# Altium schematic sheet ClockCircuit.SchDoc
size A; SheetNumber: 3; SheetTotal: 8
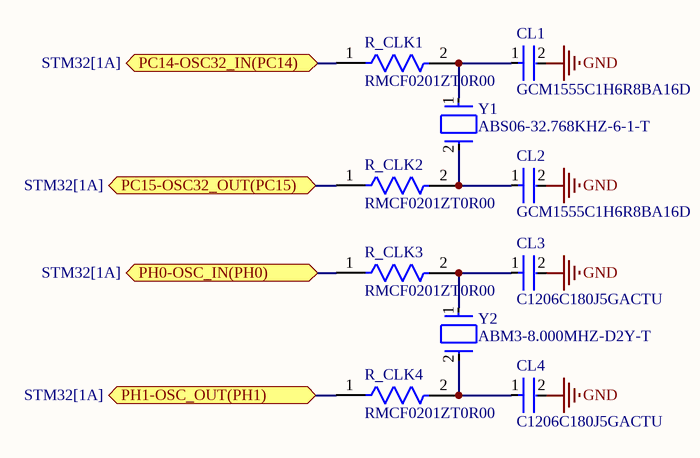
[diagram p0: ClockCircuit.SchDoc]

## Parts
CL1  GCM1555C1H6R8BA16D  [FP-GCM155-0_05-MFG]
CL2  GCM1555C1H6R8BA16D  [FP-GCM155-0_05-MFG]
CL3  C1206C180J5GACTU  [FP-C1206C-EB-MFG]
CL4  C1206C180J5GACTU  [FP-C1206C-EB-MFG]
R_CLK1  RMCF0201ZT0R00  [FP-RMCF0201-IPC_C]
R_CLK2  RMCF0201ZT0R00  [FP-RMCF0201-IPC_C]
R_CLK3  RMCF0201ZT0R00  [FP-RMCF0201-IPC_C]
R_CLK4  RMCF0201ZT0R00  [FP-RMCF0201-IPC_C]
Y1  ABS06-32.768KHZ-6-1-T  [FP-ABS06-MFG]
Y2  ABM3-8.000MHZ-D2Y-T  [FP-ABM3-MFG]

## Ports
PC14-OSC32_IN(PC14) (bidir, see STM32[1A]), PC15-OSC32_OUT(PC15) (bidir, see STM32[1A]), PH0-OSC_IN(PH0) (bidir, see STM32[1A]), PH1-OSC_OUT(PH1) (bidir, see STM32[1A])

## Nets
GND: CL1.2 CL2.2 CL3.2 CL4.2
PC14-OSC32_IN(PC14): R_CLK1.1 ; port PC14-OSC32_IN(PC14)
PC15-OSC32_OUT(PC15): R_CLK2.1 ; port PC15-OSC32_OUT(PC15)
PH0-OSC_IN(PH0): R_CLK3.1 ; port PH0-OSC_IN(PH0)
PH1-OSC_OUT(PH1): R_CLK4.1 ; port PH1-OSC_OUT(PH1)
NetCL1_1: CL1.1 R_CLK1.2 Y1.1
NetCL2_1: CL2.1 R_CLK2.2 Y1.2
NetCL3_1: CL3.1 R_CLK3.2 Y2.1
NetCL4_1: CL4.1 R_CLK4.2 Y2.2

## Library data of the parts
CL1 CL2 = CMP-06035-015550-1: Ceramic Capacitor for Automotive 6.8pF ±0.1pF 50VDC C0G 0402 Paper T/R; Voltage Rating: 50V; Capacitance: 6.8pF; Case/Package: 0402; Packaging: Cut Tape; Max Operating Temperature: 125°C; Mount: Surface Mount; Ratings: AEC-Q200; Min Operating Temperature: -55°C
CL3 CL4 = CMP-1037-00893-2: 1206 C 18pF Ceramic Multilayer Capacitor; 50 VDC; +125degC; C0G Dielec; +/-5%; Manufacturer: KEMET; Tolerance: 0.05; Temperature Coefficient: 15%; Automotive Grade: Grade 0; Voltage Rating: 50 V; Description: C1206 18 pF C0G 5.00% 50 V; Temperature Range High: +150°C; Lead Free: Yes; Device Class L3: Ceramic Capacitors; Capacitance: 18 pF; ComponentLink2Description: Datasheet; ComponentLink2URL: https://content.kemet.com/datasheets/KEM_C1007_X8R_ULTRA_150C_SMD.pdf; Digikey Description: 1206 C 18pF Ceramic Multilayer Capacitor; 50 VDC; +125degC; C0G Dielec; +/-5%; Device Class L1: Passive Components; Automotive: Yes; Temperature Range Low: -55°C; Ipc Land Pattern Name: CAPC320160X78; Temperature Characteristic: C0G; Value: 18 pF; Height: 0.88mm; Mouser Description: 1206 C 18pF Ceramic Multilayer Capacitor; 50 VDC; +125degC; C0G Dielec; +/-5%; Material: Ceramic; Octopart: https://octopart.com/c1206c180j5gactu-kemet-90945; Device Class L2: Capacitors; RoHS: TRUE; Package: C1206C-EB; Manufacturer Part Number: C1206C180J5GACTU; Temperature: -55°C to +150°C; Category: Cap
R_CLK1-R_CLK4 = CMP-26527-001890-1: 0Ω ±0 0.05W 0201 Thick Film Chip Resistor AEC-Q200 compliant; Max Power Dissipation: 50mW; Resistance: 0R; Packaging: Tape and Reel; Case/Package: 0201; Lead Free: Lead Free; Mount: Surface Mount; Series: RMCF; Power Rating: 50mW; Max Operating Temperature: 125°C; Resistor Type: Thick Film; Height - Seated (Max): 0.01inch; Package Quantity: 10000; RoHS Compliant: Yes; Case Code (Metric): 0603; Height: 0.009inch; Radiation Hardening: No; Case Code (Imperial): 0201; Number of Terminations: 2; Contact Plating: Tin; Width: 0.012inch; Min Operating Temperature: -55°C; Length: 0.024inch
Y1 = CMP-27762-015779-1: Crystal 32.768kHz ±10ppm (Tol) 6pF FUND 90kΩ 2-Pin Mini-CSMD T/R; ESR (Equivalent Series Resistance): 90kR; Series: ABS06; RoHS Compliant: Yes; Frequency: 32.768kHz; Packaging: Tape and Reel; Frequency Tolerance: 10ppm; Min Operating Temperature: -40°C; Max Operating Temperature: 85°C; Load Capacitance: 6pF; Mount: Surface Mount; Case/Package: SMD/SMT
Y2 = CMP-2000-05033-2: Crystal 8MHz ±20ppm 18pF SMD-2 5mm x 3.2mm; Series Resistance: 500R; Frequency Stability: 30ppm; ESR (Equivalent Series Resistance): 140R; Load Capacitance: 18pF; Height: 0.051inch; Tolerance: 20ppm; Depth: 3.2mm; Max Operating Temperature: 85°C; Frequency: 8MHz; Termination: SMD/SMT; Lead Free: Lead Free; Number of Pins: 2; Width: 3.2mm; RoHS Compliant: Yes; Resistor Type: Ceramic; Length: 5mm; Mount: Surface Mount; Case/Package: CSMD; Package Quantity: 1000; Radiation Hardening: No; Min Operating Temperature: -40°C; Packaging: Tape and Reel; Frequency Tolerance: 20ppm